# EAGLE schematic T07 -Schematic V4 (EAGLE 7.7.0)
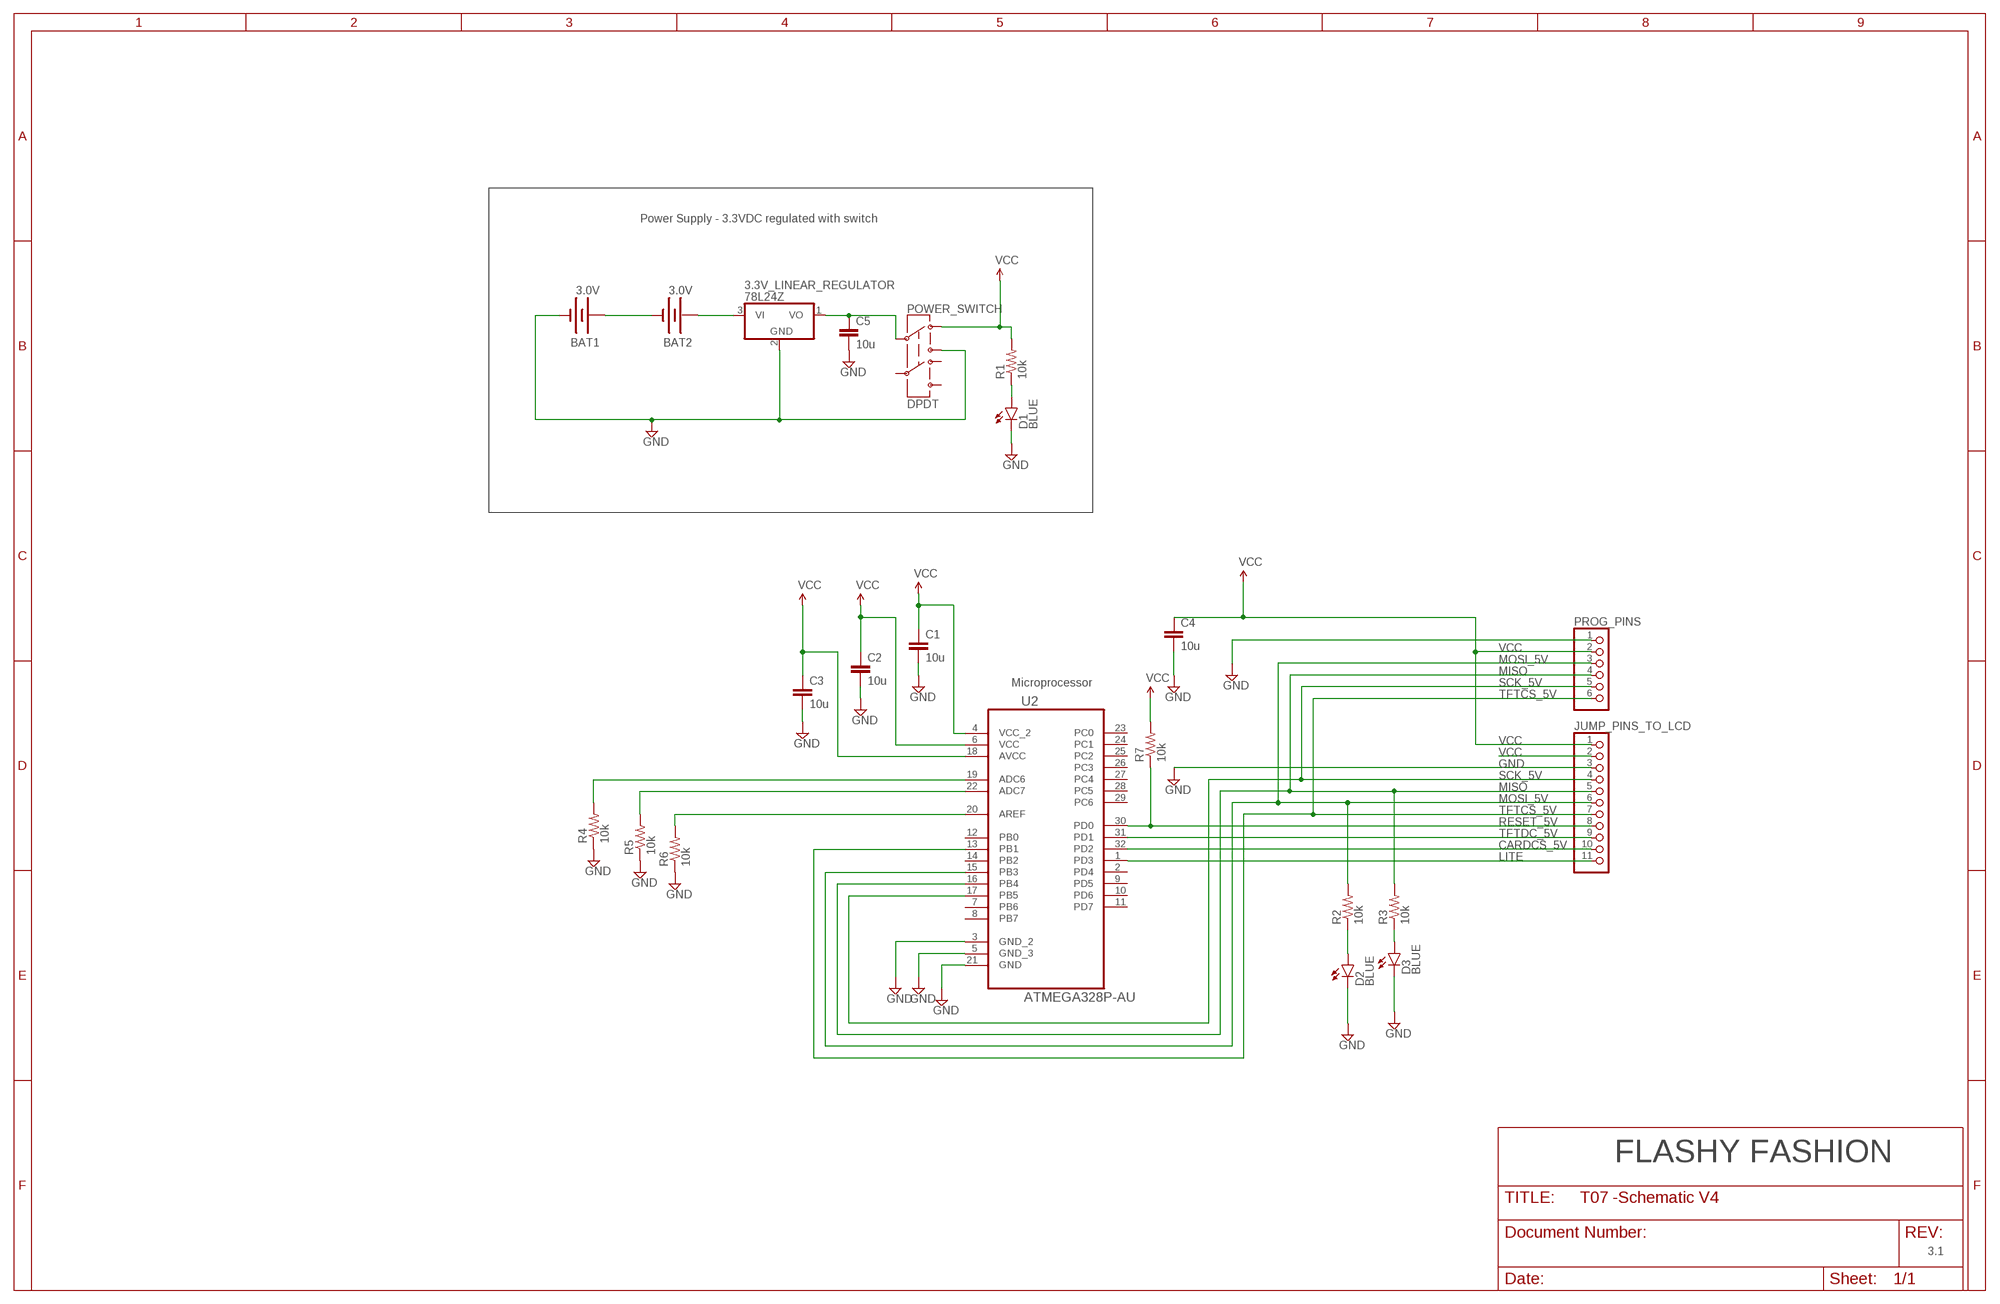
[diagram p0: schematic, sheet 1]

## Parts
3.3V_LINEAR_REGULATOR  78L24Z  [TO92]
BAT1  3.0V  BATTERY245PTH  [BATTCON_245MM_PTH]
BAT2  3.0V  BATTERY245PTH  [BATTCON_245MM_PTH]
C1  10u  CAP1206  [1206]
C2  10u  CAP1206  [1206]
C3  10u  CAP1206  [1206]
C4  10u  CAP1206  [1206]
C5  10u  CAP1206  [1206]
D1  BLUE  LED-BLUE1206  [LED-1206]
D2  BLUE  LED-BLUE1206  [LED-1206]
D3  BLUE  LED-BLUE1206  [LED-1206]
JUMP_PINS_TO_LCD  HEADER-1X1176MIL  [1X11_ROUND_76]
POWER_SWITCH  DPDT  SWITCH-DPDTAYZ0202  [AYZ0202]
PROG_PINS  PINHD-1X6-3.5MM  [1X06-3.5MM]
R1  10k  RESISTOR1206  [1206]
R2  10k  RESISTOR1206  [1206]
R3  10k  RESISTOR1206  [1206]
R4  10k  RESISTOR1206  [1206]
R5  10k  RESISTOR1206  [1206]
R6  10k  RESISTOR1206  [1206]
R7  10k  RESISTOR1206  [1206]
U2  ATMEGA328P-AU  [QFP80P900X900X120-32N]

## Nets
CARDCS_5V: JUMP_PINS_TO_LCD.10 U2.32(PD2)
GND: 3.3V_LINEAR_REGULATOR.2(GND) BAT1.2(-) C1.2 C2.2 C3.2 C4.2 C5.2 D1.C D2.C D3.C JUMP_PINS_TO_LCD.3 POWER_SWITCH.3 PROG_PINS.1 R4.1 R5.1 R6.1 U2.3(GND_2) U2.5(GND_3) U2.21(GND)
LITE: JUMP_PINS_TO_LCD.11 U2.1(PD3)
MISO: JUMP_PINS_TO_LCD.5 PROG_PINS.4 R3.2 U2.16(PB4)
MOSI_5V: JUMP_PINS_TO_LCD.6 PROG_PINS.3 R2.2 U2.15(PB3)
N$1: BAT1.3(+) BAT2.2(-)
N$2: 3.3V_LINEAR_REGULATOR.3(VI) BAT2.3(+)
N$3: D1.A R1.1
N$4: JUMP_PINS_TO_LCD.2
N$5: R4.2 U2.19(ADC6)
N$7: 3.3V_LINEAR_REGULATOR.1(VO) C5.1 POWER_SWITCH.2
N$8: D2.A R2.1
N$9: D3.A R3.1
N$10: R5.2 U2.22(ADC7)
N$11: R6.2 U2.20(AREF)
RESET_5V: JUMP_PINS_TO_LCD.8 R7.1 U2.30(PD0)
SCK_5V: JUMP_PINS_TO_LCD.4 PROG_PINS.5 U2.17(PB5)
TFTCS_5V: JUMP_PINS_TO_LCD.7 PROG_PINS.6 U2.13(PB1)
TFTDC_5V: JUMP_PINS_TO_LCD.9 U2.31(PD1)
VCC: C1.1 C2.1 C3.1 C4.1 JUMP_PINS_TO_LCD.1 POWER_SWITCH.1 PROG_PINS.2 R1.2 R7.2 U2.4(VCC_2) U2.6(VCC) U2.18(AVCC)
Unconnected: POWER_SWITCH.4 POWER_SWITCH.5 POWER_SWITCH.6 U2.2(PD4) U2.7(PB6) U2.8(PB7) U2.9(PD5) U2.10(PD6) U2.11(PD7) U2.12(PB0) U2.14(PB2) U2.23(PC0) U2.24(PC1) U2.25(PC2) U2.26(PC3) U2.27(PC4) U2.28(PC5) U2.29(PC6)

## Notes on the sheet
- Power Supply - 3.3VDC regulated with switch
- Microprocessor
- FLASHY FASHION
- 3.1

## Library data of the parts
3.3V_LINEAR_REGULATOR = adafruit:78*: Positive VOLTAGE REGULATOR Added bigger pads to the TO-92 package
BAT1 BAT2 = SparkFun-Electromechanical:BATTERY: Battery Holders Various common sizes : AA, AAA, 18650 (PRT-12895), 20mm coin cell and 12mm coin cell. 20MM_4LEGS, BATT-10373
C1-C5 = SparkFun-Capacitors:CAP: Capacitor Standard 0603 ceramic capacitor, and 0.1" leaded capacitor.
D1-D3 = SparkFun-LED:LED-BLUE: Blue LEDs for production use Various blue LEDs stocked by SparkFun production 0603 - DIO-08575 Rebel - DIO-09553 1206 - DIO-09911; PROD_ID: DIO-09911
JUMP_PINS_TO_LCD = microbuilder:HEADER-1X11
POWER_SWITCH = SparkFun-Electromechanical:SWITCH-DPDT: DPDT Version of the COM-00597; PROD_ID: SWCH-08179
PROG_PINS = adafruit:PINHD-1X6: PIN HEADER
R1-R6 = SparkFun-Resistors:RESISTOR: Resistor Basic schematic elements and footprints for 0603, 1206, and PTH resistors.
R7 = SparkFun-Passives:RESISTOR: Resistor Basic schematic elements and footprints for 0603, 1206, and PTH resistors.
U2 = Atmel_By_element14_Batch_1-00:ATMEGA328P-AU: 8-bit Microcontroller with In-System Programmable Flash; MPN: ATMEGA328P-AU; OC_FARNELL: 1715486; OC_NEWARK: 14R4631; PACKAGE: TQFP-32; SUPPLIER: Atmel

## Net classes
1 power: width 0.406 mm